# Altium schematic sheet RMT_PWR_SCH.SchDoc: RMT_POWER
size A4
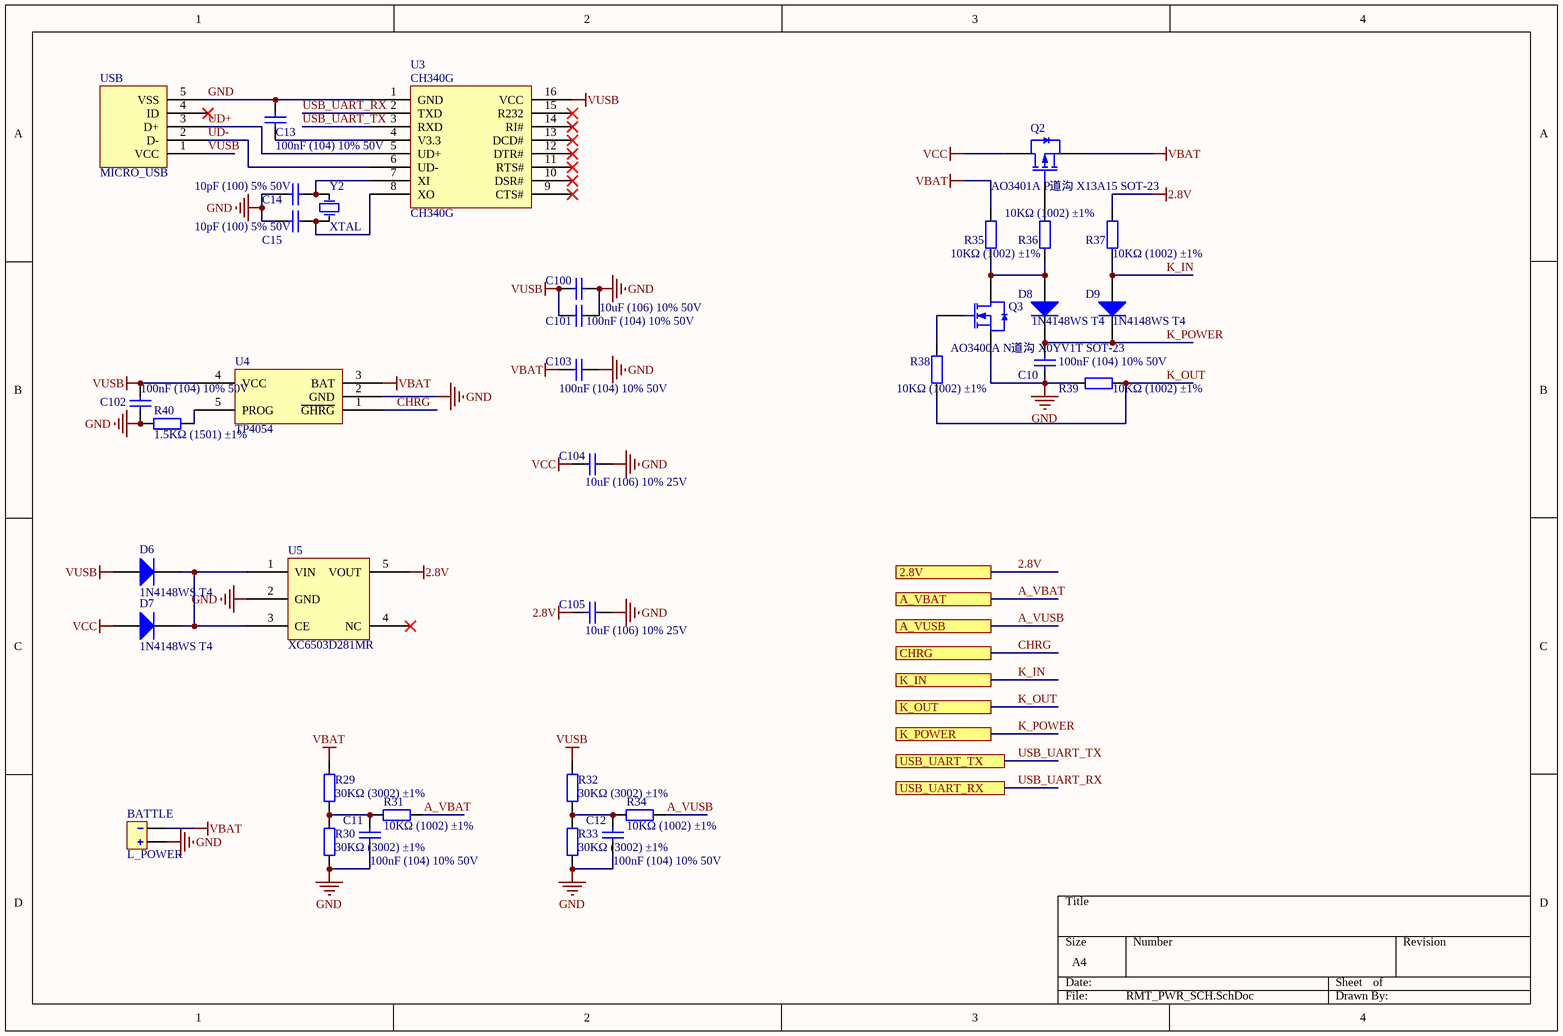
[diagram p0: RMT_PWR_SCH.SchDoc]

## Parts
BATTLE  L_POWER  [MOLEX-53398-02]
C10  100nF (104) 10% 50V  [0603_C]
C11  100nF (104) 10% 50V  [0603_C]
C12  100nF (104) 10% 50V  [0603_C]
C13  100nF (104) 10% 50V  [0603_C]
C14  10pF (100) 5% 50V  [0603_C]
C15  10pF (100) 5% 50V  [0603_C]
C100  10uF (106) 10% 50V  [1206_C]
C101  100nF (104) 10% 50V  [0603_C]
C102  100nF (104) 10% 50V  [0603_C]
C103  100nF (104) 10% 50V  [0603_C]
C104  10uF (106) 10% 25V  [0805_C]
C105  10uF (106) 10% 25V  [0805_C]
D6  1N4148WS T4  [SOD-323]
D7  1N4148WS T4  [SOD-323]
D8  1N4148WS T4  [SOD-323]
D9  1N4148WS T4  [SOD-323]
Q2  AO3401A P道沟 X13A15 SOT-23  [SOT-23-3L]
Q3  AO3400A N道沟 X0YV1T SOT-23  [SOT-23-3L]
R29  30KΩ (3002) ±1%  [0603_R]
R30  30KΩ (3002) ±1%  [0603_R]
R31  10KΩ (1002) ±1%  [0603_R]
R32  30KΩ (3002) ±1%  [0603_R]
R33  30KΩ (3002) ±1%  [0603_R]
R34  10KΩ (1002) ±1%  [0603_R]
R35  10KΩ (1002) ±1%  [0603_R]
R36  10KΩ (1002) ±1%  [0603_R]
R37  10KΩ (1002) ±1%  [0603_R]
R38  10KΩ (1002) ±1%  [0603_R]
R39  10KΩ (1002) ±1%  [0603_R]
R40  1.5KΩ (1501) ±1%  [0603_R]
U3  CH340G  [SOIC-16_150mil]
U4  TP4054  [SOT-23-5]
U5  XC6503D281MR  [SOT23-5]
USB  MICRO_USB  [MICRO-USB-B]
Y2  XTAL  [5032]

## Ports
2.8V, A_VBAT, A_VUSB, CHRG, K_IN, K_OUT, K_POWER, USB_UART_RX, USB_UART_TX

## Nets
2.8V: C105.2 R37.2 U5.5(VOUT) ; port 2.8V
GND: BATTLE.1 C10.1 C11.1 C12.1 C13.2 C14.2 C15.2 C100.1 C101.1 C102.1 C103.1 C104.1 C105.1 Q3.2(S) R30.1 R33.1 R39.1 R40.2 U3.1(GND) U4.2(GND) U5.2(GND) USB.5(VSS)
VBAT: BATTLE.2 C103.2 Q2.2(S) R29.2 R35.2 U4.3(BAT)
VCC: C104.2 D7.1(A) Q2.3(D)
VUSB: C100.2 C101.2 C102.2 D6.1(A) R32.2 U3.16(VCC) U4.4(VCC) USB.1(VCC)
A_VBAT: R31.2 ; port A_VBAT
A_VUSB: R34.2 ; port A_VUSB
CHRG: U4.1(~{GHRG}) ; port CHRG
K_IN: D9.1(A) R37.1 ; port K_IN
K_OUT: R38.1 R39.2 ; port K_OUT
K_POWER: C10.2 D8.2(K) D9.2(K) ; port K_POWER
UD+: U3.5(UD+) USB.3(D+)
UD-: U3.6(UD-) USB.2(D-)
USB_UART_RX: U3.2(TXD) ; port USB_UART_RX
USB_UART_TX: U3.3(RXD) ; port USB_UART_TX
NetC11_2: C11.2 R29.1 R30.2 R31.1
NetC12_2: C12.2 R32.1 R33.2 R34.1
NetC13_1: C13.1 U3.4(V3.3)
NetC14_1: C14.1 U3.7(XI) Y2.1(OSC1)
NetC15_1: C15.1 U3.8(XO) Y2.2(OSC2)
NetD6_2: D6.2(K) D7.2(K) U5.1(VIN) U5.3(CE)
NetD8_1: D8.1(A) Q3.3(D) R35.1 R36.1
NetQ2_1: Q2.1(G) R36.2
NetQ3_1: Q3.1(G) R38.2
NetR40_1: R40.1 U4.5(PROG)

Not connected (* = marked no-connect by the designer): U3 9(CTS#)* 10(DSR#)* 11(RTS#)* 12(DTR#)* 13(DCD#)* 14(RI#)* 15(R232)*; U5 4(NC)*; USB 4(ID)*

## Library data of the parts
BATTLE = L_POWER: 电源输入
C10-C13 C101-C103 = 0603 100nF (104) 10% 50V: 贴片电容; ComponentLink1Description: 供应商链接; ComponentLink1URL: http://www.szlcsc.com/product/details_15331.html; Package: 0603; Supplier: LC; SuppliersPartNumber: C14663
C14 C15 = 0603 10pF (100) 5% 50V: 贴片电容; ComponentLink1Description: 供应商链接; ComponentLink1URL: http://www.szlcsc.com/product/details_1986.html; Package: 0603; Supplier: LC; SuppliersPartNumber: C1634
C100 = 1206 10uF (106) 10% 50V: 贴片电容; ComponentLink1Description: 供应商链接; ComponentLink1URL: http://www.szlcsc.com/product/details_14236.html; Package: 1206; Supplier: LC; SuppliersPartNumber: C13585
C104 C105 = 0805 10uF (106) 10% 25V: 贴片电容; ComponentLink1Description: 供应商链接; ComponentLink1URL: http://www.szlcsc.com/product/details_16532.html; Package: 0805; Supplier: LC; SuppliersPartNumber: C15850
D6-D9 = SOD-323 1N4148WS T4: 二极管; ComponentLink1Description: 供应商链接; ComponentLink1URL: http://www.szlcsc.com/product/details_2485.html; Package: SOD-323; Supplier: LC; SuppliersPartNumber: C2128
Q2 = AO3401A P道沟 X13A15 SOT-23: MOS(场效应管); ComponentLink1Description: 供应商链接; ComponentLink1URL: http://www.szlcsc.com/product/details_15801.html; Package: SOT-23; Supplier: LC; SuppliersPartNumber: C15127
Q3 = AO3400A N道沟 X0YV1T SOT-23: MOS(场效应管); ComponentLink1Description: 供应商链接; ComponentLink1URL: http://www.szlcsc.com/product/details_21629.html; Package: SOT-23; Supplier: LC; SuppliersPartNumber: C20917
R29 R30 R32 R33 = 0603 30KΩ (3002) 1%: 贴片电阻; ComponentLink1Description: 供应商链接; ComponentLink1URL: http://www.szlcsc.com/product/details_23711.html; Package: 0603; Supplier: LC; SuppliersPartNumber: C22984
R31 R34-R39 = 0603 10KΩ (1002) 1%: 贴片电阻; ComponentLink1Description: 供应商链接; ComponentLink1URL: http://www.szlcsc.com/product/details_26547.html; Package: 0603; Supplier: LC; SuppliersPartNumber: C25804
R40 = 0603 1.5KΩ (1501) 1%: 贴片电阻; ComponentLink1Description: 供应商链接; ComponentLink1URL: http://www.szlcsc.com/product/details_23570.html; Package: 0603; Supplier: LC; SuppliersPartNumber: C22843
U3 = CH340G_[C14267]: USB; ComponentLink1Description: 供应商链接; ComponentLink1URL: http://www.szlcsc.com/product/details_14927.html; Package: SOIC-16_150mil; Supplier: LC; SuppliersPartNumber: C14267
U4 = TP4054_[C32574]: 电池电源管理; ComponentLink1Description: 供应商链接; ComponentLink1URL: http://www.szlcsc.com/product/details_33539.html; Package: SOT-23-5; Supplier: LC; SuppliersPartNumber: C32574
U5 = XC6503D281MR: 2.8V 500ma线性稳压器
USB = MICRO_USB: MICRO USB 接口
Y2 = XTAL: 无源晶振